# Altium schematic sheet WiFi_Lock.SchDoc
size A3; Organization: Altium Limited; Address1: L3, 12a Rodborough Rd; Address2: Frenchs Forest; Address3: NSW; Address4: Australia 2086
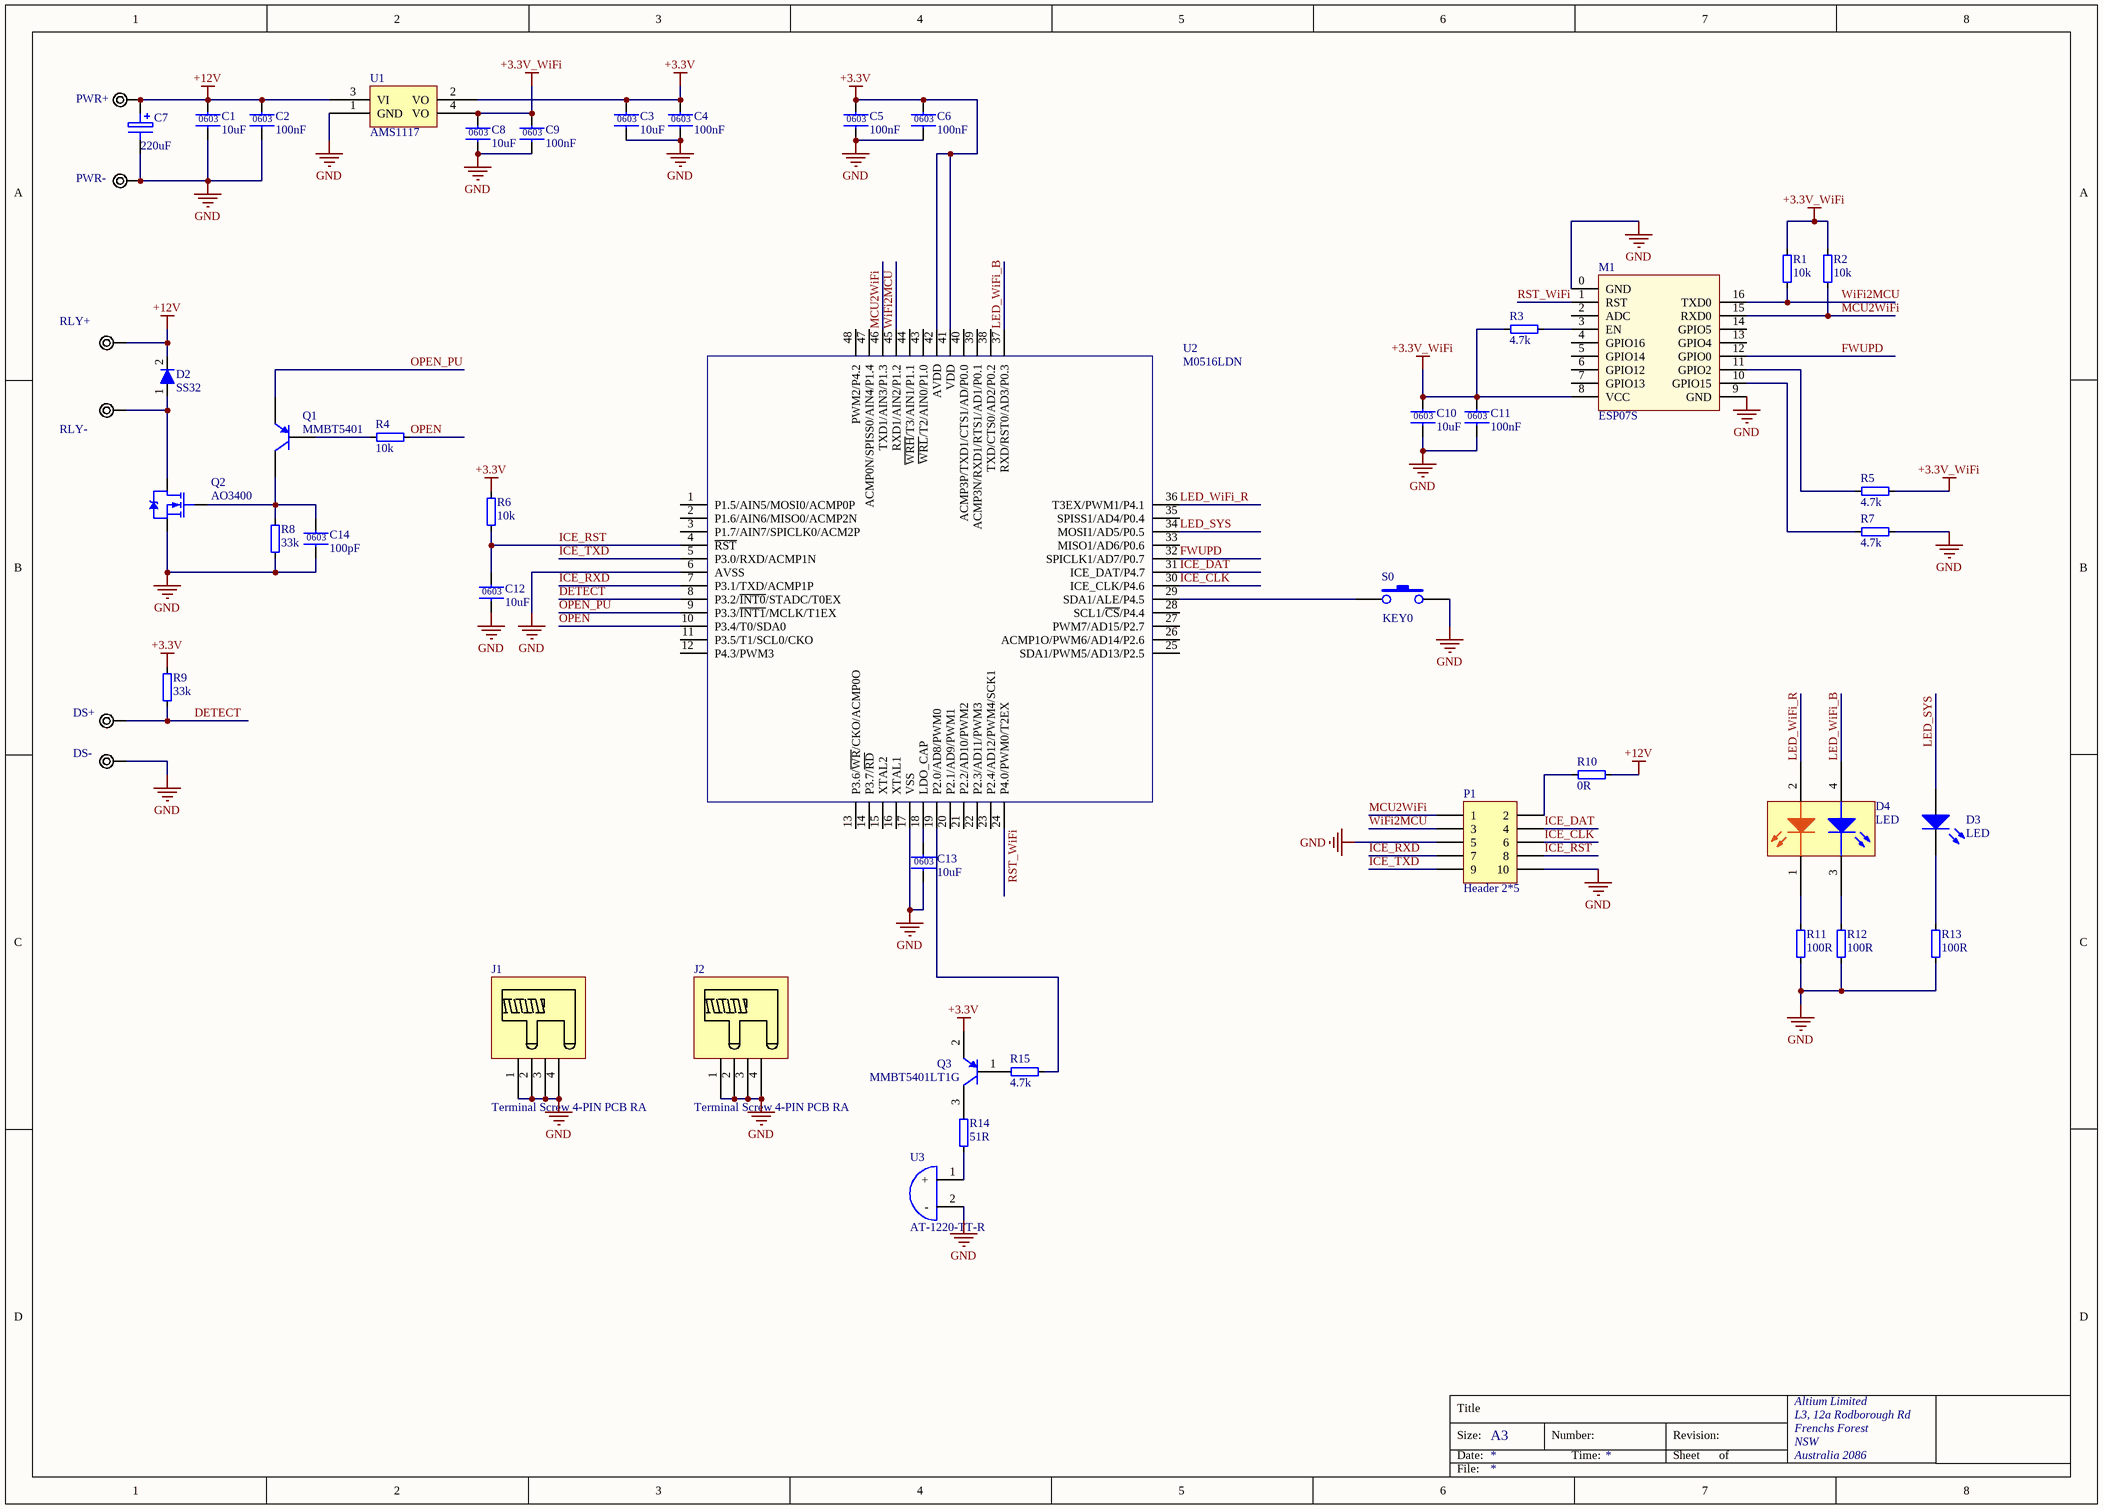
[diagram p0: WiFi_Lock.SchDoc]

## Parts
C1  10uF  [0603]
C2  100nF  [0603]
C3  10uF  [0603]
C4  100nF  [0603]
C5  100nF  [0603]
C6  100nF  [0603]
C7  220uF  [SMD-EC-F6.3]
C8  10uF  [0603]
C9  100nF  [0603]
C10  10uF  [0603]
C11  100nF  [0603]
C12  10uF  [0603]
C13  10uF  [0603]
C14  100pF  [0603]
D2  SS32  [DO-214AC]
D3  LED  [0603]
D4  LED  [DLED2.00x1.25mm]
J1  Terminal Screw 4-PIN PCB RA  [TERMSCREW4-B11.5X8.5X7.8mm/T5.0X7.5mm/RA]
J2  Terminal Screw 4-PIN PCB RA  [TERMSCREW4-B11.5X8.5X7.8mm/T5.0X7.5mm/RA]
M1  ESP07S  [ESP-07S Module]
P1  Header 2*5  [HDR2X5T0.1]
PAD1  PWR+  [PAD-MUL-ROUND-D1.5H0.6]  (no BOM)
PAD2  PWR-  [PAD-MUL-ROUND-D1.5H0.6]  (no BOM)
PAD3  RLY+  [PAD-MUL-ROUND-D1.5H0.6]  (no BOM)
PAD4  RLY-  [PAD-MUL-ROUND-D1.5H0.6]  (no BOM)
PAD5  DS+  [PAD-MUL-ROUND-D1.5H0.6]  (no BOM)
PAD6  DS-  [PAD-MUL-ROUND-D1.5H0.6]  (no BOM)
Q1  MMBT5401  [SOT95P230X110-3N]
Q2  AO3400  [SOT95P230X110-3N]
Q3  MMBT5401LT1G  [ONSC-SOT-23-3-318-08_V]
R1  10k  [0603]
R2  10k  [0603]
R3  4.7k  [0603]
R4  10k  [0603]
R5  4.7k  [0603]
R6  10k  [0603]
R7  4.7k  [0603]
R8  33k  [0603]
R9  33k  [0603]
R10  0R  [0603]
R11  100R  [0603]
R12  100R  [0603]
R13  100R  [0603]
R14  51R  [0603]
R15  4.7k  [0603]
S0  KEY0  [SW6.00x3.00mm]
U1  AMS1117  [SOT-223]
U2  M0516LDN  [LQFP-48]
U3  AT-1220-TT-R  [Transducer_12mm(D)x8.5mm(H)_6.5mm(P)]

## Nets
+3.3V: C3.1 C4.1 C5.1 C6.1 Q3.2(E) R6.1 R9.2 U1.2(VO) U2.41(VDD) U2.42(AVDD)
+3.3V_WiFi: C8.1 C9.1 C10.1 C11.1 M1.8(VCC) R1.2 R2.2 R3.1 R5.2 U1.4(VO)
+12V: C1.1 C2.1 C7.1 D2.2(K) PAD1.1 PAD3.1 R10.2 U1.3(VI)
GND: C1.2 C2.2 C3.2 C4.2 C5.2 C6.2 C7.2 C8.2 C9.2 C10.2 C11.2 C12.2 C13.2 C14.2 J1.1 J1.2 J1.3 J1.4 J2.1 J2.2 J2.3 J2.4 M1.0(GND) M1.9(GND) P1.5 P1.10 PAD2.1 PAD6.1 Q2.2(S) R7.2 R8.1 R11.1 R12.1 R13.1 S0.2 U1.1(GND) U2.6(AVSS) U2.17(VSS) U3.2(-)
DETECT: PAD5.1 R9.1 U2.8(P3.2/~{INT0}/STADC/T0EX)
FWUPD: M1.12(GPIO0) U2.32(SPICLK1/AD7/P0.7)
ICE_CLK: P1.6 U2.30(ICE_CLK/P4.6)
ICE_DAT: P1.4 U2.31(ICE_DAT/P4.7)
ICE_RST: C12.1 P1.8 R6.2 U2.4(~{RST})
ICE_RXD: P1.7 U2.7(P3.1/TXD/ACMP1P)
ICE_TXD: P1.9 U2.5(P3.0/RXD/ACMP1N)
LED_SYS: D3.1(A) U2.34(MOSI1/AD5/P0.5)
LED_WiFi_B: D4.4(BA) U2.37(RXD/RST0/AD3/P0.3)
LED_WiFi_R: D4.2(RA) U2.36(T3EX/PWM1/P4.1)
MCU2WiFi: M1.15(RXD0) P1.1 R2.1 U2.46(TXD1/AIN3/P1.3)
OPEN: R4.1 U2.10(P3.4/T0/SDA0)
OPEN_PU: Q1.2(E) U2.9(P3.3/~{INT1}/MCLK/T1EX)
RST_WiFi: M1.1(RST) U2.24(P4.0/PWM0/T2EX)
WiFi2MCU: M1.16(TXD0) P1.3 R1.1 U2.45(RXD1/AIN2/P1.2)
NetC13_1: C13.1 U2.18(LDO_CAP)
NetC14_1: C14.1 Q1.3(C) Q2.1(G) R8.2
NetD2_1: D2.1(A) PAD4.1 Q2.3(D)
NetD3_2: D3.2(K) R13.2
NetD4_1: D4.1(RK) R11.2
NetD4_3: D4.3(BK) R12.2
NetM1_3: M1.3(EN) R3.2
NetM1_10: M1.10(GPIO15) R7.1
NetM1_11: M1.11(GPIO2) R5.1
NetP1_2: P1.2 R10.1
NetQ1_1: Q1.1(B) R4.2
NetQ3_1: Q3.1(B) R15.1
NetQ3_3: Q3.3(C) R14.2
NetR14_1: R14.1 U3.1(+)
NetR15_2: R15.2 U2.19(P2.0/AD8/PWM0)
NetS0_1: S0.1 U2.29(SDA1/ALE/P4.5)

Not connected (* = marked no-connect by the designer): M1 2(ADC) 4(GPIO16) 5(GPIO14) 6(GPIO12) 7(GPIO13) 13(GPIO4) 14(GPIO5); U2 1(P1.5/AIN5/MOSI0/ACMP0P) 2(P1.6/AIN6/MISO0/ACMP2N) 3(P1.7/AIN7/SPICLK0/ACM2P) 11(P3.5/T1/SCL0/CKO) 12(P4.3/PWM3) 13(P3.6/~{WR}/CKO/ACMP0O) 14(P3.7/~{RD}) 15(XTAL2) 16(XTAL1) 20(P2.1/AD9/PWM1) 21(P2.2/AD10/PWM2) 22(P2.3/AD11/PWM3) 23(P2.4/AD12/PWM4/SCK1) 25(SDA1/PWM5/AD13/P2.5) 26(ACMP1O/PWM6/AD14/P2.6) 27(PWM7/AD15/P2.7) 28(SCL1/~{CS}/P4.4) 33(MISO1/AD6/P0.6) 35(SPISS1/AD4/P0.4) 38(TXD/CTS0/AD2/P0.2) 39(ACMP3N/RXD1/RTS1/AD1/P0.1) 40(ACMP3P/TXD1/CTS1/AD/P0.0) 43(~{WRL}/T2/AIN0/P1.0) 44(~{WRH}/T3/AIN1/P1.1) 47(ACMP0N/SPISS0/AIN4/P1.4) 48(PWM2/P4.2)

## Notes on the sheet
- Title
- Size:
- Date:
- A3
- Number:
- Time:
- Revision:
- Sheet
- of
- File:
- (in symbol CAP0603) 0603

## Library data of the parts
C1-C6 C8-C14 = CAP0603
C7 = EEE-FPC221XAP: 220μF 16V Aluminum Electrolytic Capacitors Radial, Can - SMD 160 mohm @ 100kHz 2000 Hrs @ 105°C; Manufacturer: Panasonic Electronic Components; Package: SMD-EC-F6.3; PackageDescription: SMD Aluminum Electrolytic Capacitors, Dia 6.3mm, Height 7.7mm; PartNumber: EEE-FPC221XAP; Supplier 1: Digi-Key; Supplier Part Number 1: PCE4537TR-ND
D2 = Diode
D3 = LED: Typical INFRARED GaAs LED; Published: 8-Jun-2000; LatestRevisionDate: 08-Jul-2005; LatestRevisionNote: Mech Layer 1 removed.; PackageReference: LED-0; Publisher: Altium Limited
D4 = LED-RB: Red & Blue
J1 J2 = Terminal Screw 4-PIN PCB RA: Terminal Screw 4-PIN, Thru Hole, PCB Right Angle
M1 = ESP-07S Module: ESP-07S Wi-Fi Module
P1 = Header 2*5: Header, 2-Pin, Dual row; LatestRevisionDate: 17-Jul-2002; LatestRevisionNote: Re-released for DXP Platform.; Publisher: Altium Limited
PAD1-PAD6 = PAD: Probe, Test Point
Q1 = MMBT5401: PNP General Purpose Amplifier; Manufacture: NXP Semiconductor; Package: SOT-23; Part Number: MMBT5401
Q2 = AO3400: 30V 5.8A N-Channel MOSFET, MAX VGS = 1.45V
Q3 = MMBT5401LT1G: High Voltage Transistor, PNP Silicon, 3-Pin SOT-23, Pb-Free, Tape and Reel; Manufacturer: On Semiconductor; fT Min (MHz): 100; IC Continuous (A): -0.5; DatasheetVersion: Rev. 11; PackageVersion: Rev. AP, 11/2009; PackageReference: SOT-23-3-318-08; PackageDescription: 3-Pin Small Outline Transistor, Body 2.92 x 1.3 mm, Pitch 0.95 mm; Supplier 1: Digi-Key; Supplier Part Number 1: MMBT5401LT1GOSTR-ND; Supplier 2: Digi-Key; Supplier Part Number 2: MMBT5401LT1GOSCT-ND; Supplier 3: Digi-Key; Supplier Part Number 3: MMBT5401LT1GOSDKR-ND; Supplier 4: Farnell; Supplier Part Number 4: 1459108; Supplier 5: Farnell; Supplier Part Number 5: 1459108RL; Supplier 6: Farnell; Supplier Part Number 6: 2317820; Supplier 7: Newark; Supplier Part Number 7: 88H4794; Supplier 8: Newark; Supplier Part Number 8: 67R1344; Supplier 9: Mouser; Supplier Part Number 9: 863-MMBT5401LT1G; Packing: Tape and Reel; Polarity: PNP; RoHS: TRUE; Mounting Technology: Surface Mount; PartNumber: MMBT5401LT1G; ComponentLink1Description: Manufacturer URL; ComponentLink1URL: http://www.onsemi.com/; ComponentLink2Description: Datasheet; ComponentLink2URL: http://www.onsemi.cn/pub_link/Collateral/MMBT5401LT1-D.PDF; ComponentLink3Description: Package Specification; ComponentLink3URL: http://www.onsemi.cn/pub_link/Collateral/318-08.PDF
R1-R15 = RES
S0 = SW-TACT: Top push Switch
U1 = AMS1117: 三端线性稳压
U2 = M0516LDN: ARM Cortex -M0 32-bit Microcontroller
U3 = AT-1220-TT-R: Buzzers Transducer, Externally Driven Magnetic 1.5V 10mA 2.048kHz 82dB @ 1.5V, 10cm Through Hole PC Pins; Manufacturer: PUI Audio Inc.; PartNumber: AT-1220-TT-R; PackageDescription: Transducer, Body Dia 12.00mm, Height 8.7mm (max), 6.5mm Pitch; Supplier 1: Digi-Key; Supplier Part Number 1: 668-1097-ND; Package: Transducer_12mm(D)x8.5mm(H)_6.5mm(P)